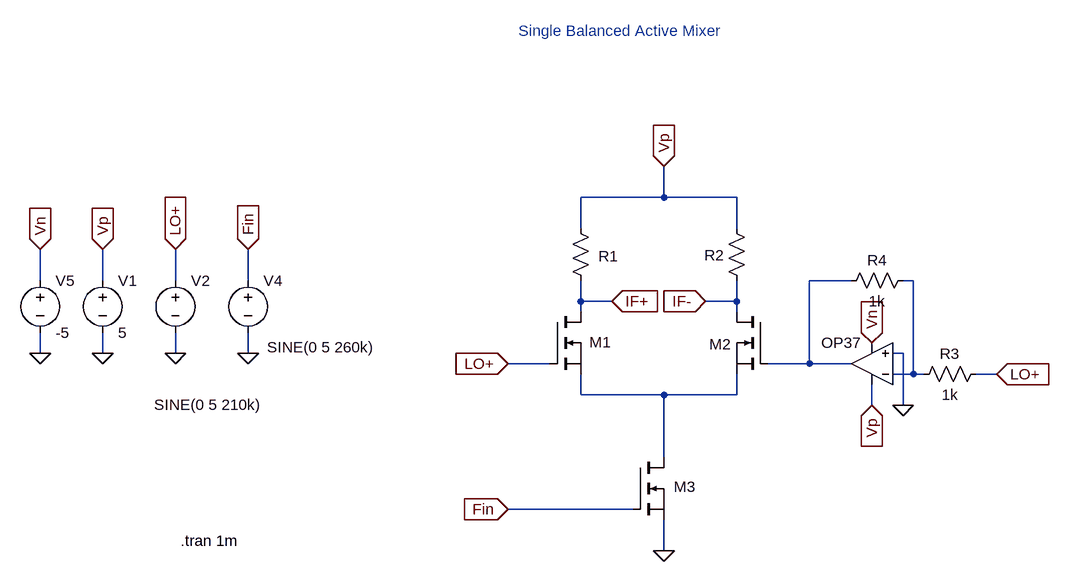
[diagram p0: schematic singlebal_ltspice.asc]
singlebal_ltspice.asc, the LTspice schematic file:
Version 4
SHEET 1 1100 680
WIRE 352 -224 352 -272
WIRE 352 -224 224 -224
WIRE 464 -224 352 -224
WIRE 224 -176 224 -224
WIRE 464 -176 464 -224
WIRE -608 -96 -608 -144
WIRE -512 -96 -512 -144
WIRE -400 -96 -400 -144
WIRE -288 -96 -288 -144
WIRE 640 -96 576 -96
WIRE 736 -96 720 -96
WIRE 224 -64 224 -96
WIRE 272 -64 224 -64
WIRE 464 -64 464 -96
WIRE 464 -64 416 -64
WIRE 224 -48 224 -64
WIRE 464 -48 464 -64
WIRE -608 16 -608 -16
WIRE -512 16 -512 -16
WIRE -400 16 -400 -16
WIRE -288 16 -288 -16
WIRE 720 16 704 16
WIRE 176 32 112 32
WIRE 576 32 576 -96
WIRE 576 32 512 32
WIRE 640 32 576 32
WIRE 736 48 736 -96
WIRE 736 48 704 48
WIRE 752 48 736 48
WIRE 864 48 832 48
WIRE 224 80 224 48
WIRE 352 80 224 80
WIRE 464 80 464 48
WIRE 464 80 352 80
WIRE 672 96 672 64
WIRE 720 96 720 16
WIRE 352 176 352 80
WIRE 304 256 112 256
WIRE 352 320 352 272
FLAG 352 320 0
FLAG 352 -272 Vp
IOPIN 352 -272 In
FLAG 112 32 LO+
IOPIN 112 32 In
FLAG 112 256 Fin
IOPIN 112 256 In
FLAG -512 16 0
FLAG -400 16 0
FLAG -288 16 0
FLAG -512 -144 Vp
IOPIN -512 -144 In
FLAG -400 -144 LO+
IOPIN -400 -144 In
FLAG -288 -144 Fin
IOPIN -288 -144 In
FLAG 272 -64 IF+
IOPIN 272 -64 In
FLAG 416 -64 IF-
IOPIN 416 -64 In
FLAG 720 96 0
FLAG 672 96 Vp
IOPIN 672 96 In
FLAG 864 48 LO+
IOPIN 864 48 In
FLAG 672 0 Vn
IOPIN 672 0 In
FLAG -608 -144 Vn
IOPIN -608 -144 In
FLAG -608 16 0
SYMBOL nmos 176 -48 R0
WINDOW 0 61 47 Left 2
WINDOW 3 56 72 Invisible 2
SYMATTR InstName M1
SYMATTR Value BSP89
SYMBOL nmos 512 -48 M0
WINDOW 0 56 50 Left 2
WINDOW 3 56 72 Invisible 2
SYMATTR InstName M2
SYMATTR Value BSP89
SYMBOL nmos 304 176 R0
WINDOW 0 63 45 Left 2
WINDOW 3 56 72 Invisible 2
SYMATTR InstName M3
SYMATTR Value BSP89
SYMBOL res 208 -192 R0
WINDOW 0 43 59 Left 2
WINDOW 3 36 76 Invisible 2
SYMATTR InstName R1
SYMATTR Value 6.8k
SYMBOL res 448 -192 R0
WINDOW 0 -34 57 Left 2
WINDOW 3 36 76 Invisible 2
SYMATTR InstName R2
SYMATTR Value 6.8k
SYMBOL voltage -512 -112 R0
WINDOW 123 0 0 Left 0
WINDOW 39 0 0 Left 0
SYMATTR InstName V1
SYMATTR Value 5
SYMBOL voltage -400 -112 R0
WINDOW 123 0 0 Left 0
WINDOW 39 0 0 Left 0
WINDOW 3 -33 207 Left 2
SYMATTR Value SINE(0 5 210k)
SYMATTR InstName V2
SYMBOL voltage -288 -112 R0
WINDOW 123 0 0 Left 0
WINDOW 39 0 0 Left 0
WINDOW 3 29 119 Left 2
SYMATTR Value SINE(0 5 260k)
SYMATTR InstName V4
SYMBOL Opamps\\OP37 672 96 R180
WINDOW 0 16 32 Invisible 2
SYMATTR InstName U1
SYMBOL res 848 32 R90
WINDOW 0 0 56 VBottom 2
WINDOW 3 32 56 VTop 2
SYMATTR InstName R3
SYMATTR Value 1k
SYMBOL res 736 -112 R90
WINDOW 0 0 56 VBottom 2
WINDOW 3 32 56 VTop 2
SYMATTR InstName R4
SYMATTR Value 1k
SYMBOL voltage -608 -112 R0
WINDOW 123 0 0 Left 0
WINDOW 39 0 0 Left 0
SYMATTR InstName V5
SYMATTR Value -5
TEXT -392 304 Left 2 !.tran 1m
TEXT 128 -480 Left 2 ;Single Balanced Active Mixer

The netlist it stands for:
* singlebal_ltspice.asc
M1 IF+ LO+ N003 N003 BSP89
M2 IF- N001 N003 N003 BSP89
M3 N003 Fin 0 0 BSP89
R1 Vp IF+ 6.8k
R2 Vp IF- 6.8k
V1 Vp 0 5
V2 LO+ 0 SINE(0 5 210k)
V4 Fin 0 SINE(0 5 260k)
XU1 0 N002 Vp Vn N001 LT1037  ; OP37, pins In+ In- V+ V- OUT
R3 LO+ N002 1k
R4 N002 N001 1k
V5 Vn 0 -5
.model NMOS NMOS
.model PMOS PMOS
.lib standard.mos
.tran 1m
* Single Balanced Active Mixer
.lib LTC.lib
.backanno
.end